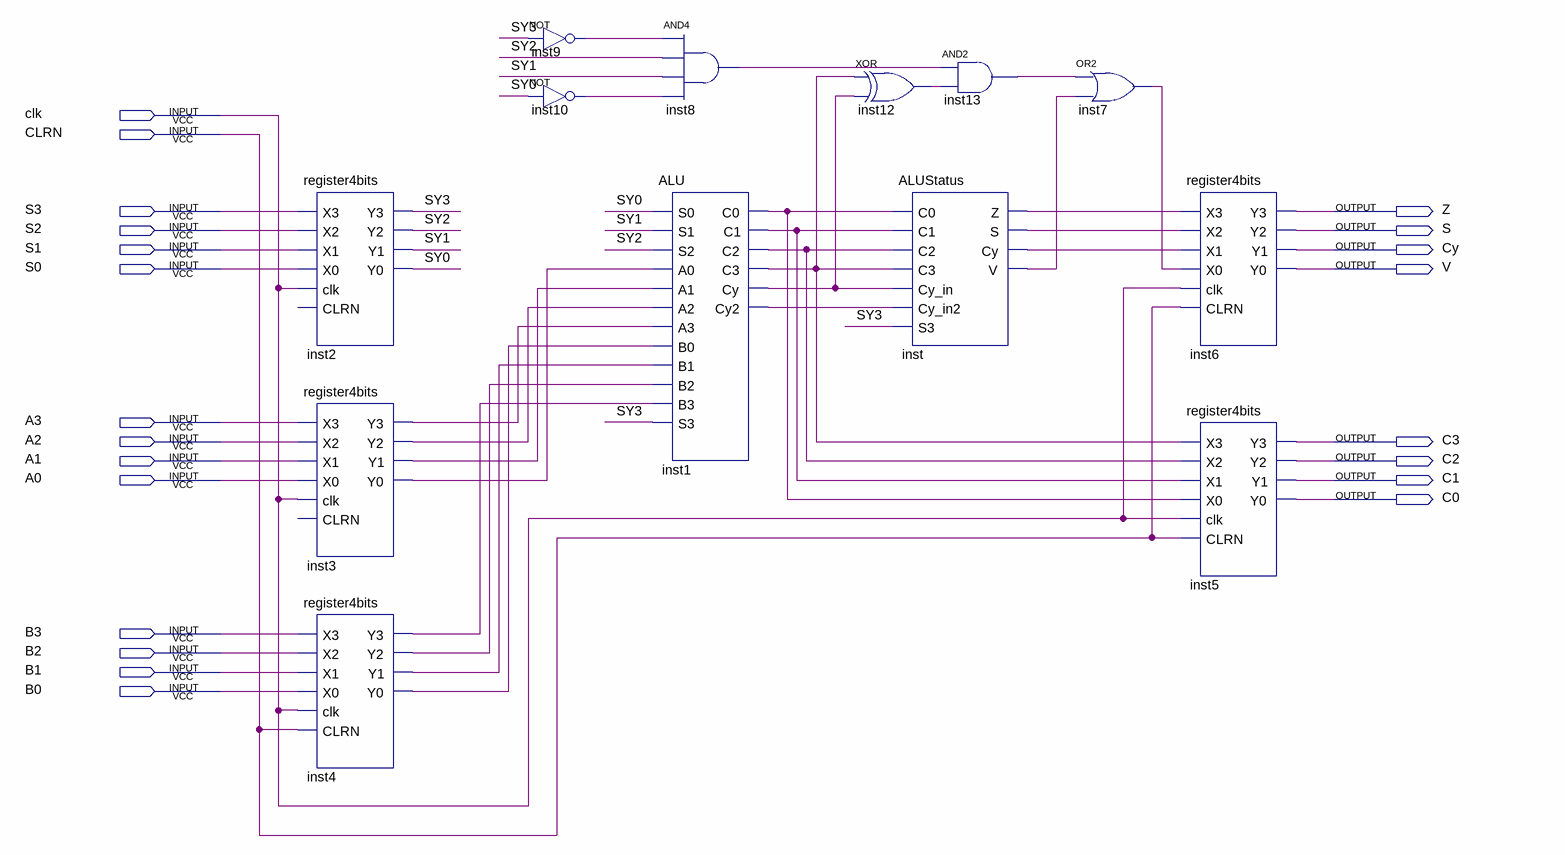
[diagram p0: schematic sheet]
// Quartus schematic lab3top.bdf as structural Verilog: 13 symbols, 22 pins
module lab3top (
  input  clk,
  input  CLRN,
  input  S3,
  input  S2,
  input  S1,
  input  S0,
  input  A3,
  input  A2,
  input  A1,
  input  A0,
  input  B3,
  input  B2,
  input  B1,
  input  B0,
  output Z,
  output S,
  output Cy,
  output V,
  output C3,
  output C2,
  output C1,
  output C0
);

  wire inst1_c0, inst1_c1, inst1_c2, inst1_c3, inst1_cy, inst1_cy2, inst3_y0, inst3_y1, inst3_y2, inst3_y3,
       inst4_y0, inst4_y1, inst4_y2, inst4_y3, inst7_out, inst8_out, inst9_out, inst10_out, inst12_out,
       inst13_out, inst_cy, inst_s, inst_v, inst_z, SY0, SY1, SY2, SY3;

  register4bits inst2 (
    .X3(S3), .X2(S2), .X1(S1), .X0(S0), .clk(clk), .Y3(SY3), .Y2(SY2), .Y1(SY1), .Y0(SY0));  // open: CLRN
  register4bits inst3 (
    .X3(A3), .X2(A2), .X1(A1), .X0(A0), .clk(clk), .Y3(inst3_y3), .Y2(inst3_y2), .Y1(inst3_y1), .Y0(inst3_y0));  // open: CLRN
  register4bits inst4 (
    .X3(B3), .X2(B2), .X1(B1), .X0(B0), .clk(clk), .CLRN(CLRN), .Y3(inst4_y3), .Y2(inst4_y2), .Y1(inst4_y1),
    .Y0(inst4_y0));
  not inst9 (inst9_out, SY3);
  not inst10 (inst10_out, SY0);
  and inst8 (inst8_out, inst9_out, SY2, SY1, inst10_out);
  ALU inst1 (
    .S0(SY0), .S1(SY1), .S2(SY2), .A0(inst3_y0), .A1(inst3_y1), .A2(inst3_y2), .A3(inst3_y3), .B0(inst4_y0),
    .B1(inst4_y1), .B2(inst4_y2), .B3(inst4_y3), .S3(SY3), .C0(inst1_c0), .C1(inst1_c1), .C2(inst1_c2),
    .C3(inst1_c3), .Cy(inst1_cy), .Cy2(inst1_cy2));
  xor inst12 (inst12_out, inst1_c3, inst1_cy);
  ALUStatus inst (
    .C0(inst1_c0), .C1(inst1_c1), .C2(inst1_c2), .C3(inst1_c3), .Cy_in(inst1_cy), .Cy_in2(inst1_cy2),
    .S3(SY3), .Z(inst_z), .S(inst_s), .Cy(inst_cy), .V(inst_v));
  and inst13 (inst13_out, inst8_out, inst12_out);
  or inst7 (inst7_out, inst13_out, inst_v);
  register4bits inst6 (
    .X3(inst_z), .X2(inst_s), .X1(inst_cy), .X0(inst7_out), .clk(clk), .CLRN(CLRN), .Y3(Z), .Y2(S), .Y1(Cy),
    .Y0(V));
  register4bits inst5 (
    .X3(inst1_c3), .X2(inst1_c2), .X1(inst1_c1), .X0(inst1_c0), .clk(clk), .CLRN(CLRN), .Y3(C3), .Y2(C2),
    .Y1(C1), .Y0(C0));
endmodule
